# EAGLE design Witch (EAGLE 9.5.2)
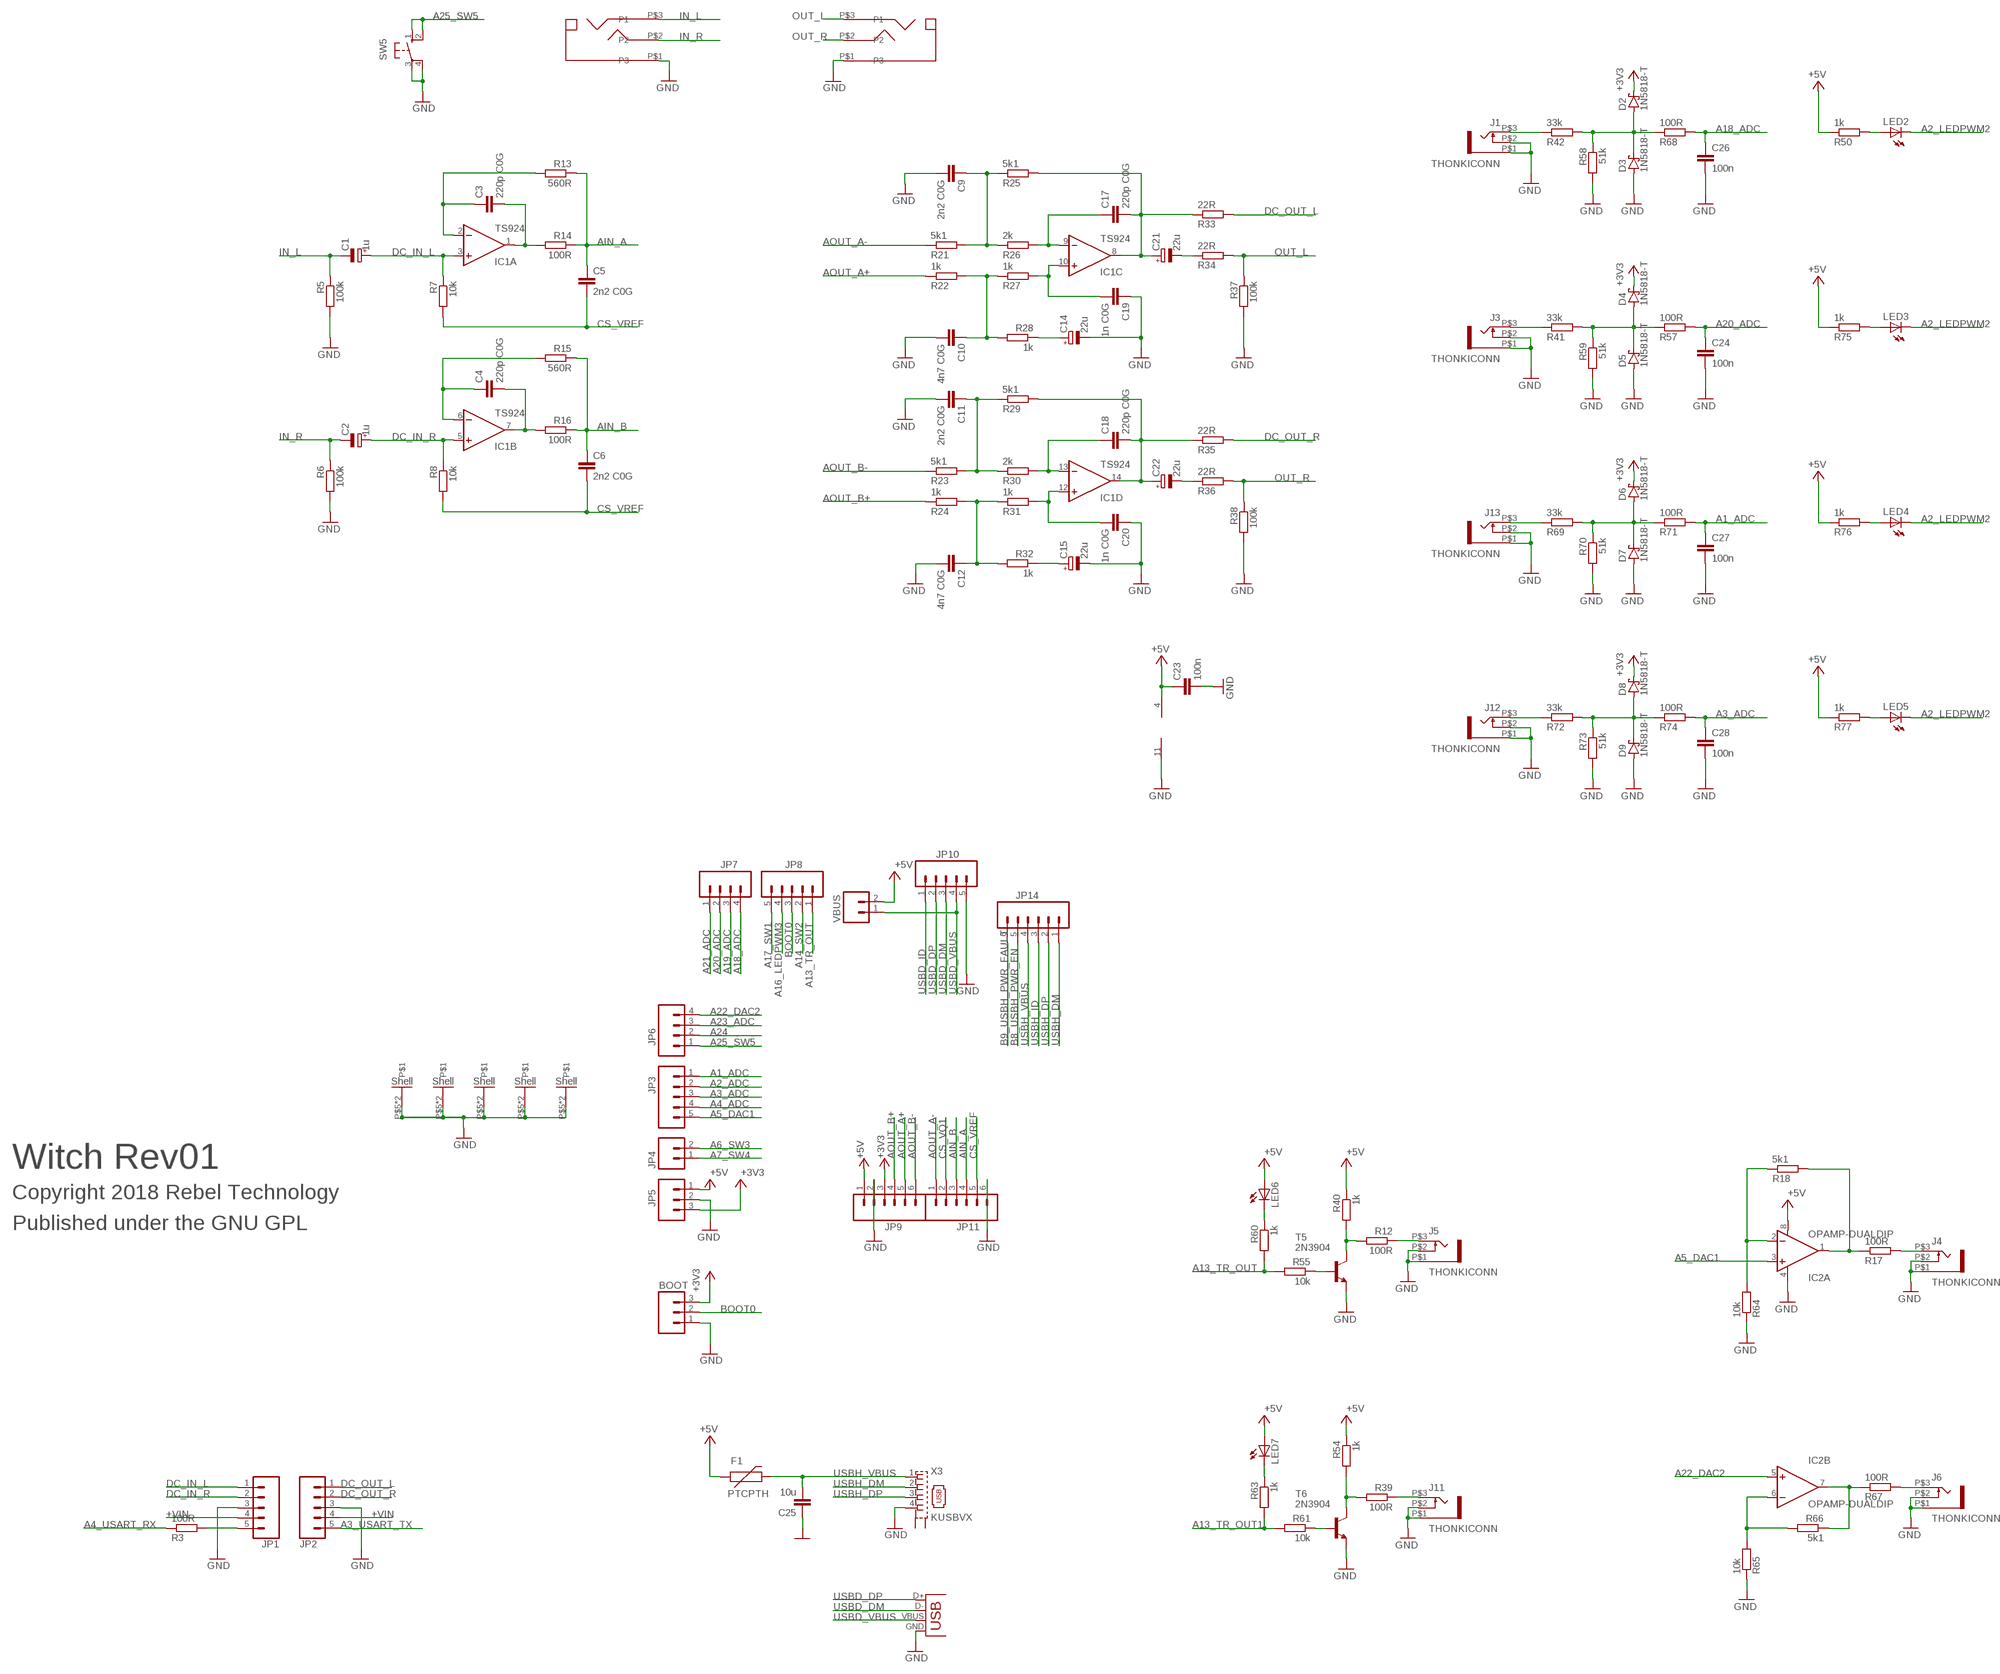
[diagram p0: schematic, sheet 1, part 1 of 2]
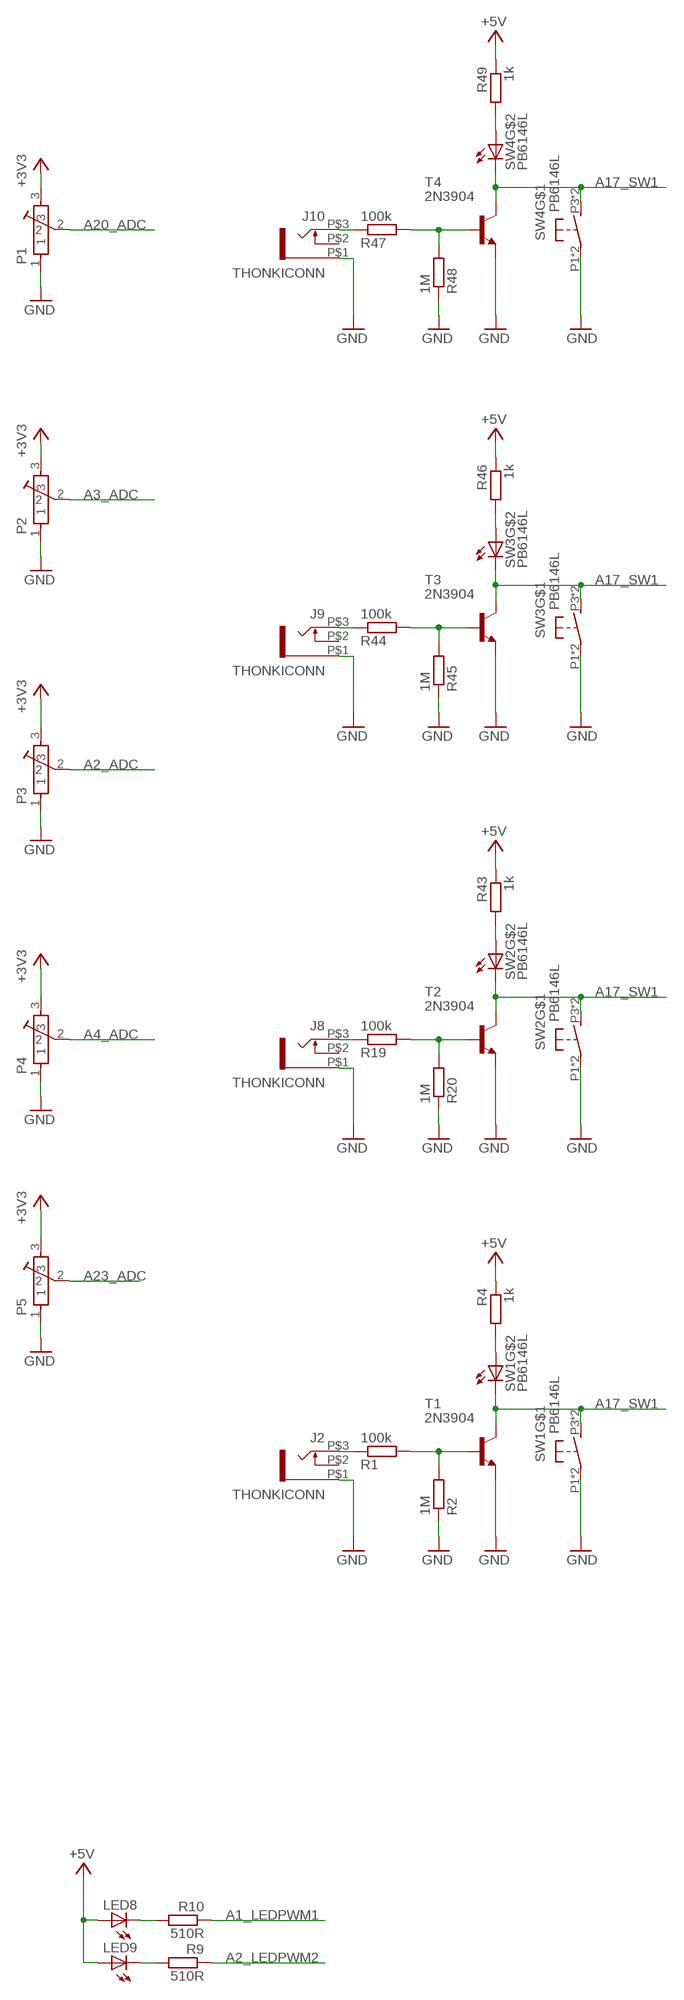
[diagram p1: schematic, sheet 1, part 2 of 2]

## Parts
BOOT  M03PTH  [1X03]
C1  1u  CPOL-EUE5-6  [E5-6]
C2  1u  CPOL-EUE5-6  [E5-6]
C3  220p C0G  C-EU050-024X044  [C050-024X044]
C4  220p C0G  C-EU050-024X044  [C050-024X044]
C5  2n2 C0G  C-EU050-024X044  [C050-024X044]
C6  2n2 C0G  C-EU050-024X044  [C050-024X044]
C9  2n2 C0G  C-EU050-024X044  [C050-024X044]
C10  4n7 C0G  C-EU050-024X044  [C050-024X044]
C11  2n2 C0G  C-EU050-024X044  [C050-024X044]
C12  4n7 C0G  C-EU050-024X044  [C050-024X044]
C14  22u  CPOL-EUE5-6  [E5-6]
C15  22u  CPOL-EUE5-6  [E5-6]
C17  220p C0G  C-EU050-024X044  [C050-024X044]
C18  220p C0G  C-EU050-024X044  [C050-024X044]
C19  1n C0G  C-EU050-024X044  [C050-024X044]
C20  1n C0G  C-EU050-024X044  [C050-024X044]
C21  22u  CPOL-EUE5-6  [E5-6]
C22  22u  CPOL-EUE5-6  [E5-6]
C23  100n  C-EU050-024X044  [C050-024X044]
C24  100n  C-EU050-024X044  [C050-024X044]
C25  10u  C-EU050-024X044  [C050-024X044]
C26  100n  C-EU050-024X044  [C050-024X044]
C27  100n  C-EU050-024X044  [C050-024X044]
C28  100n  C-EU050-024X044  [C050-024X044]
D2  1N5818-T  [DO41-7.6]
D3  1N5818-T  [DO41-7.6]
D4  1N5818-T  [DO41-7.6]
D5  1N5818-T  [DO41-7.6]
D6  1N5818-T  [DO41-7.6]
D7  1N5818-T  [DO41-7.6]
D8  1N5818-T  [DO41-7.6]
D9  1N5818-T  [DO41-7.6]
F1  PTCPTH  [PTC]
IC1  TS924  LM324N  [DIL14]
IC2  OPAMP-DUALDIP  [DIP08]
J1  THONKICONN  [THONKICONN]
J2  THONKICONN  [THONKICONN]
J3  THONKICONN  [THONKICONN]
J4  THONKICONN  [THONKICONN]
J5  THONKICONN  [THONKICONN]
J6  THONKICONN  [THONKICONN]
J8  THONKICONN  [THONKICONN]
J9  THONKICONN  [THONKICONN]
J10  THONKICONN  [THONKICONN]
J11  THONKICONN  [THONKICONN]
J12  THONKICONN  [THONKICONN]
J13  THONKICONN  [THONKICONN]
JP1  CONN_05JST-VERT  [JST-5-PTH-VERT]
JP2  CONN_05JST-VERT  [JST-5-PTH-VERT]
JP3  M05PTH  [1X05]
JP4  M02PTH  [1X02]
JP5  M03PTH  [1X03]
JP6  M04PTH  [1X04]
JP7  M04PTH  [1X04]
JP8  M05PTH  [1X05]
JP9  M06SIP  [1X06]
JP10  M05PTH  [1X05]
JP11  M06SIP  [1X06]
JP14  M06SIP  [1X06]
LED2  LED3MM  [LED3MM]
LED3  LED3MM  [LED3MM]
LED4  LED3MM  [LED3MM]
LED5  LED3MM  [LED3MM]
LED6  LED3MM  [LED3MM]
LED7  LED3MM  [LED3MM]
LED8  LED3MM  [LED3MM]
LED9  LED3MM  [LED3MM]
P1  POT-ALPS-RK09L1140  [POT-ALPS-RK09L1140]
P2  POT-ALPS-RK09L1140  [POT-ALPS-RK09L1140]
P3  POT-ALPS-RK09L1140  [POT-ALPS-RK09L1140]
P4  POT-ALPS-RK09L1140  [POT-ALPS-RK09L1140]
P5  POT-ALPS-RK09L1140  [POT-ALPS-RK09L1140]
R1  100k  R-EU_0204/7  [0204/7]
R2  1M  R-EU_0204/7  [0204/7]
R3  100R  R-EU_0204/7  [0204/7]
R4  1k  R-EU_0204/7  [0204/7]
R5  100k  R-EU_0204/7  [0204/7]
R6  100k  R-EU_0204/7  [0204/7]
R7  10k  R-EU_0204/7  [0204/7]
R8  10k  R-EU_0204/7  [0204/7]
R9  510R  R-EU_0204/7  [0204/7]
R10  510R  R-EU_0204/7  [0204/7]
R12  100R  R-EU_0204/7  [0204/7]
R13  560R  R-EU_0204/7  [0204/7]
R14  100R  R-EU_0204/7  [0204/7]
R15  560R  R-EU_0204/7  [0204/7]
R16  100R  R-EU_0204/7  [0204/7]
R17  100R  R-EU_0204/7  [0204/7]
R18  5k1  R-EU_0204/7  [0204/7]
R19  100k  R-EU_0204/7  [0204/7]
R20  1M  R-EU_0204/7  [0204/7]
R21  5k1  R-EU_0204/7  [0204/7]
R22  1k  R-EU_0204/7  [0204/7]
R23  5k1  R-EU_0204/7  [0204/7]
R24  1k  R-EU_0204/7  [0204/7]
R25  5k1  R-EU_0204/7  [0204/7]
R26  2k  R-EU_0204/7  [0204/7]
R27  1k  R-EU_0204/7  [0204/7]
R28  1k  R-EU_0204/7  [0204/7]
R29  5k1  R-EU_0204/7  [0204/7]
R30  2k  R-EU_0204/7  [0204/7]
R31  1k  R-EU_0204/7  [0204/7]
R32  1k  R-EU_0204/7  [0204/7]
R33  22R  R-EU_0204/7  [0204/7]
R34  22R  R-EU_0204/7  [0204/7]
R35  22R  R-EU_0204/7  [0204/7]
R36  22R  R-EU_0204/7  [0204/7]
R37  100k  R-EU_0204/7  [0204/7]
R38  100k  R-EU_0204/7  [0204/7]
R39  100R  R-EU_0204/7  [0204/7]
R40  1k  R-EU_0204/7  [0204/7]
R41  33k  R-EU_0204/7  [0204/7]
R42  33k  R-EU_0204/7  [0204/7]
R43  1k  R-EU_0204/7  [0204/7]
R44  100k  R-EU_0204/7  [0204/7]
R45  1M  R-EU_0204/7  [0204/7]
R46  1k  R-EU_0204/7  [0204/7]
R47  100k  R-EU_0204/7  [0204/7]
R48  1M  R-EU_0204/7  [0204/7]
R49  1k  R-EU_0204/7  [0204/7]
R50  1k  R-EU_0204/7  [0204/7]
R54  1k  R-EU_0204/7  [0204/7]
R55  10k  R-EU_0204/7  [0204/7]
R57  100R  R-EU_0204/7  [0204/7]
R58  51k  R-EU_0204/7  [0204/7]
R59  51k  R-EU_0204/7  [0204/7]
R60  1k  R-EU_0204/7  [0204/7]
R61  10k  R-EU_0204/7  [0204/7]
R63  1k  R-EU_0204/7  [0204/7]
R64  10k  R-EU_0204/7  [0204/7]
R65  10k  R-EU_0204/7  [0204/7]
R66  5k1  R-EU_0204/7  [0204/7]
R67  100R  R-EU_0204/7  [0204/7]
R68  100R  R-EU_0204/7  [0204/7]
R69  33k  R-EU_0204/7  [0204/7]
R70  51k  R-EU_0204/7  [0204/7]
R71  100R  R-EU_0204/7  [0204/7]
R72  33k  R-EU_0204/7  [0204/7]
R73  51k  R-EU_0204/7  [0204/7]
R74  100R  R-EU_0204/7  [0204/7]
R75  1k  R-EU_0204/7  [0204/7]
R76  1k  R-EU_0204/7  [0204/7]
R77  1k  R-EU_0204/7  [0204/7]
SW1  PB6146L  [PB6146L]
SW2  PB6146L  [PB6146L]
SW3  PB6146L  [PB6146L]
SW4  PB6146L  [PB6146L]
SW5  10-XX  [B3F-10XX]
T1  2N3904  [TO92]
T2  2N3904  [TO92]
T3  2N3904  [TO92]
T4  2N3904  [TO92]
T5  2N3904  [TO92]
T6  2N3904  [TO92]
U$4  THONKICONN_STEREO  [THONKICONN_STEREO]
U$5  THONKICONN_STEREO  [THONKICONN_STEREO]
VBUS  M02PTH  [1X02]
X3  KUSBVX  [KUSBVX]
X5  USBPTH-VERTICAL  [USB-B-PTH-VERTICAL]

## Nets
+3V3: BOOT.3 D2.C D4.C D6.C D8.C JP5.3 JP9.3 P1.3 P2.3 P3.3 P4.3 P5.3
+5V: C23.1 F1.P$1 IC1.4(P:V+) IC2.8(A:V+) JP5.1 JP9.1 LED6.A LED7.A LED8.A LED9.A R4.1 R40.1 R43.1 R46.1 R49.1 R50.1 R54.1 R75.1 R76.1 R77.1 VBUS.2
+VIN: JP1.4 JP2.4
A1_ADC: C27.1 JP3.1 R71.2
A1_LEDPWM1: R10.1
A2_ADC: JP3.2 P3.2
A2_LEDPWM2: LED2.K(C) LED3.K(C) LED4.K(C) LED5.K(C) R9.1
A3_ADC: C28.1 JP3.3 R74.2
A3_USART_TX: JP2.5
A4_ADC: JP3.4 P4.2
A4_USART_RX: R3.1
A5_DAC1: IC2.3(A:+IN) JP3.5
A6_SW3: JP4.2
A7_SW4: JP4.1
A13_TR_OUT: JP8.1 R55.2 R60.2
A13_TR_OUT1: R61.2 R63.2
A14_SW2: JP8.2
A16_LEDPWM3: JP8.4
A17_SW1: JP8.5 SW1.P3(S) SW1.P4(S) SW1.PL2(C) SW2.P3(S) SW2.P4(S) SW2.PL2(C) SW3.P3(S) SW3.P4(S) SW3.PL2(C) SW4.P3(S) SW4.P4(S) SW4.PL2(C) T1.1(C) T2.1(C) T3.1(C) T4.1(C)
A18_ADC: C26.1 JP7.4 R68.2
A19_ADC: JP7.3 P1.2
A20_ADC: C24.1 JP7.2 R57.2
A21_ADC: JP7.1 P2.2
A22_DAC2: IC2.5(B:+IN) JP6.4
A23_ADC: JP6.3 P5.2
A24: JP6.2
A25_SW5: JP6.1 SW5.1(S) SW5.2(S1)
AIN_A: C5.1 JP11.4 R13.1 R14.1
AIN_B: C6.1 JP11.3 R15.1 R16.1
AOUT_A+: JP9.5 R22.1
AOUT_A-: JP11.1 R21.1
AOUT_B+: JP9.4 R24.1
AOUT_B-: JP9.6 R23.1
B8_USBH_PWR_EN: JP14.5
B9_USBH_PWR_FAULT: JP14.6
BOOT0: BOOT.2 JP8.3
CS_VQ1: JP11.2
CS_VREF: C5.2 C6.2 JP11.5 R7.2 R8.2
DC_IN_L: C1.+ IC1.3(A:+IN) JP1.1 R7.1
DC_IN_R: C2.+ IC1.5(B:+IN) JP1.2 R8.1
DC_OUT_L: JP2.1 R33.2
DC_OUT_R: JP2.2 R35.2
GND: BOOT.1 C9.2 C10.2 C11.2 C12.2 C14.- C15.- C19.1 C20.1 C23.2 C24.2 C25.1 C26.2 C27.2 C28.2 D3.A D5.A D7.A D9.A IC1.11(P:V-) IC2.4(A:V-) J1.P$1 J1.P$2 J2.P$1 J3.P$1 J3.P$2 J4.P$1 J4.P$2 J5.P$1 J5.P$2 J6.P$1 J6.P$2 J8.P$1 J9.P$1 J10.P$1 J11.P$1 J11.P$2 J12.P$1 J12.P$2 J13.P$1 J13.P$2 JP1.3 JP2.3 JP5.2 JP9.2 JP10.5 JP11.6 P1.1 P1.P$5 P1.P$6 P2.1 P2.P$5 P2.P$6 P3.1 P3.P$5 P3.P$6 P4.1 P4.P$5 P4.P$6 P5.1 P5.P$5 P5.P$6 R2.1 R5.2 R6.2 R20.1 R37.2 R38.2 R45.1 R48.1 R58.2 R59.2 R64.1 R65.1 R70.2 R73.2 SW1.P1(P) SW1.P2(P) SW2.P1(P) SW2.P2(P) SW3.P1(P) SW3.P2(P) SW4.P1(P) SW4.P2(P) SW5.3(P) SW5.4(P1) T1.3(E) T2.3(E) T3.3(E) T4.3(E) T5.3(E) T6.3(E) U$4.P$1(P3) U$5.P$1(P3) X3.4 X5.GND
IN_L: C1.- R5.1 U$4.P$3(P1)
IN_R: C2.- R6.1 U$4.P$2(P2)
N$1: JP1.5 R3.2
N$2: J11.P$3 R39.1
N$3: C3.1 IC1.2(A:-IN) R13.2
N$4: C4.2 IC1.7(B:OUT) R16.2
N$5: C4.1 IC1.6(B:-IN) R15.2
N$6: C3.2 IC1.1(A:OUT) R14.2
N$7: C17.1 IC1.9(C:-IN) R26.2
N$8: C15.+ R32.1
N$9: C21.- R34.1
N$10: C14.+ R28.1
N$11: C19.2 IC1.10(C:+IN) R27.2
N$12: C18.2 C22.+ IC1.14(D:OUT) R29.2 R35.1
N$13: C22.- R36.1
N$14: LED8.K(C) R10.2
N$15: C10.1 R22.2 R27.1 R28.2
N$16: LED9.K(C) R9.2
N$17: D4.A D5.C R41.2 R57.1 R59.1
N$18: LED7.K(C) R63.1
N$19: J5.P$3 R12.1
N$20: IC2.2(A:-IN) R18.1 R64.2
N$21: IC2.1(A:OUT) R17.1 R18.2
N$22: J2.P$3 R1.1
N$23: R39.2 R54.2 T6.1(C)
N$24: C11.1 R23.2 R29.1 R30.1
N$25: R12.2 R40.2 T5.1(C)
N$26: C18.1 IC1.13(D:-IN) R30.2
N$27: J3.P$3 R41.1
N$28: R4.2 SW1.PL1(A)
N$29: R19.2 R20.2 T2.2(B)
N$30: C20.2 IC1.12(D:+IN) R31.2
N$31: R55.1 T5.2(B)
N$32: C12.1 R24.2 R31.1 R32.2
N$33: J1.P$3 R42.1
N$34: J8.P$3 R19.1
N$35: R43.2 SW2.PL1(A)
N$36: R44.2 R45.2 T3.2(B)
N$37: R1.2 R2.2 T1.2(B)
N$38: J9.P$3 R44.1
N$39: C17.2 C21.+ IC1.8(C:OUT) R25.2 R33.1
N$40: R46.2 SW3.PL1(A)
N$41: C9.1 R21.2 R25.1 R26.1
N$42: R47.2 R48.2 T4.2(B)
N$43: J10.P$3 R47.1
N$44: R49.2 SW4.PL1(A)
N$45: LED2.A R50.2
N$46: LED6.K(C) R60.1
N$52: D2.A D3.C R42.2 R58.1 R68.1
N$53: J13.P$3 R69.1
N$54: R61.1 T6.2(B)
N$58: D6.A D7.C R69.2 R70.1 R71.1
N$59: J12.P$3 R72.1
N$60: J4.P$3 R17.2
N$61: IC2.6(B:-IN) R65.2 R66.2
N$62: IC2.7(B:OUT) R66.1 R67.1
N$63: J6.P$3 R67.2
N$64: D8.A D9.C R72.2 R73.1 R74.1
N$65: LED3.A R75.2
N$66: LED4.A R76.2
N$67: LED5.A R77.2
OUT_L: R34.2 R37.1 U$5.P$3(P1)
OUT_R: R36.2 R38.1 U$5.P$2(P2)
USBD_DM: JP10.3 X5.D-
USBD_DP: JP10.2 X5.D+
USBD_ID: JP10.1
USBD_VBUS: JP10.4 VBUS.1 X5.VBUS
USBH_DM: JP14.1 X3.2
USBH_DP: JP14.2 X3.3
USBH_ID: JP14.3
USBH_VBUS: C25.2 F1.P$2 JP14.4 X3.1
Unconnected: J2.P$2 J8.P$2 J9.P$2 J10.P$2 X3.M1(S1) X3.M2(S2)

## Notes on the sheet
- Witch Rev01
- Copyright 2018 Rebel Technology
- Published under the GNU GPL

## Library data of the parts
BOOT JP5 = SparkFun:M03: Header 3 Standard 3-pin 0.1" header. Use with straight break away headers (SKU : PRT-00116), right angle break away headers (PRT-00553), swiss pins (PRT-00743), machine pins (PRT-00117), and female headers (PRT-00115). Molex polarized connector foot print use with SKU : PRT-08232 with associated crimp pins and housings.
C1 C2 C14 C15 C21 C22 = Rebel:CPOL-EU: POLARIZED CAPACITOR, European symbol
C3-C6 C9-C12 C17-C20 C23-C28 = resistor:C-EU: CAPACITOR, European symbol
D2-D9 = diode:1N581*: 1.0A SCHOTTKY BARRIER RECTIFIER Source: http://www.diodes.com/datasheets/ds23001.pdf
F1 = Rebel:PTC: Resettable Fuse PTC Resettable Fuse. Bourns MF-R, Raychem PolySwitch RXE.
IC1 = linear:LM324: OP AMP
IC2 = SparkFun:OPAMP-DUAL: Operational Amplifier
J1-J6 J8-J13 = Rebel:THONKICONN
JP1 JP2 = SparkFun-Connectors:CONN_05: Multi connection point. Often used as Generic Header-pin footprint for 0.1 inch spaced/style header connections On any of the 0.1 inch spaced packages, you can populate with these: Break Away Headers - Straight <https://www.sparkfun.com/products/116> (PRT-00116) Break Away Male Headers - Right Angle <https://www.sparkfun.com/products/553> (PRT-00553) Female Headers <https://www.sparkfun.com/products/115> (PRT-00115) Break Away Headers - Machine Pin <https://www.sparkfun.com/products/117> (PRT-00117) Break Away Female Headers - Swiss Machine Pin <https://www.sparkfun.com/products/743> (PRT-00743) For SCREWTERMINALS and SPRING TERMINALS visit here: Screw Terimnals on SparkFun.com <https://www.sparkfun.com/search/results?term=Screw+Terminals> (5mm/3.5mm/2.54mm spacing) This device is also useful as a general connection point to wire up your design to another part of your project. Our various solder wires solder well into these plated through hole pads. Hook-Up Wire - Assortment (Stranded, 22 AWG) <https://www.sparkfun.com/products/11375> (PRT-11375) Hook-Up Wire - Assortment (Solid Core, 22 AWG) <https://www.sparkfun.com/products/11367> (PRT-11367) View the entire wire category on our website here <https://www.sparkfun.com/categories/141> Special notes: Molex polarized connector foot print use with SKU : PRT-08231 with associated crimp pins and housings. 1MM SMD Version SKU: PRT-10208
JP3 JP8 JP10 = SparkFun:M05: Header 5 Standard 5-pin 0.1" header. Use with straight break away headers (SKU : PRT-00116), right angle break away headers (PRT-00553), swiss pins (PRT-00743), machine pins (PRT-00117), and female headers (PRT-00115). Molex polarized connector foot print use with SKU : PRT-08230 with associated crimp pins and housings.
JP4 VBUS = SparkFun:M02: Header 2 Standard 2-pin 0.1" header. Use with straight break away headers (SKU : PRT-00116), right angle break away headers (PRT-00553), swiss pins (PRT-00743), machine pins (PRT-00117), and female headers (PRT-00115). Molex polarized connector foot print use with SKU : PRT-08233 with associated crimp pins and housings.
JP6 JP7 = SparkFun:M04: Header 4 Standard 4-pin 0.1" header. Use with straight break away headers (SKU : PRT-00116), right angle break away headers (PRT-00553), swiss pins (PRT-00743), machine pins (PRT-00117), and female headers (PRT-00115). Molex polarized connector foot print use with SKU : PRT-08231 with associated crimp pins and housings. 1MM SMD Version SKU: PRT-10208
JP9 JP11 JP14 = SparkFun:M06: Header 6 Standard 6-pin 0.1" header. Use with straight break away headers (SKU : PRT-00116), right angle break away headers (PRT-00553), swiss pins (PRT-00743), machine pins (PRT-00117), and female headers (PRT-00115). Molex polarized connector foot print use with SKU : PRT-08094 with associated crimp pins and housings. NOTES ON THE VARIANTS LOCK and LOCK_LONGPADS... This footprint was designed to help hold the alignment of a through-hole component (i.e. 6-pin header) while soldering it into place. You may notice that each hole has been shifted either up or down by 0.005 of an inch from it's more standard position (which is a perfectly straight line). This slight alteration caused the pins (the squares in the middle) to touch the edges of the holes. Because they are alternating, it causes a "brace" to hold the component in place. 0.005 has proven to be the perfect amount of "off-center" position when using our standard breakaway headers. Although looks a little odd when you look at the bare footprint, once you have a header in there, the alteration is very hard to notice. Also, if you push a header all the way into place, it is covered up entirely on the bottom side. This idea of altering the position of holes to aid alignment will be further integrated into the Sparkfun Library for other footprints. It can help hold any component with 3 or more connection pins.
LED2-LED9 = Rebel:LED: LED
P1-P5 = Rebel:POT-ALPS-RK09L
R1-R10 R12-R50 R54 R55 R57-R61 R63-R77 = Rebel:R-EU_: RESISTOR, European symbol
SW1-SW4 = Rebel:PB6146L
SW5 = switch-omron:10-XX: OMRON SWITCH; MPN: B3F-1000; OC_FARNELL: 176432; OC_NEWARK: 36M3542
T1-T6 = transistor-npn:2N3904: NPN Transistor
U$4 U$5 = Rebel:THONKICONN_STEREO
X3 = con-kycon:KUSBVX: Vertical,Top Entry Universal Serial Bus Connector KUSBVX Series Source: KYCON Sibalco USB vertical socket KUSBV.pdf
X5 = SparkFun:USB: USB Connectors USB-B-PTH is fully proven SKU : PRT-00139 USB-miniB is fully proven SKU : PRT-00587 USB-A-PCB is untested. USB-A-H is throughly reviewed, but untested. Spark Fun Electronics SKU : PRT-00437 USB-B-SMT is throughly reviewed, but untested. Needs silkscreen touching up. USB-A-S has not been used/tested USB-MB-H has not been used/tested

## Net classes
1 power: width 0.178 mm, drill 0.305 mm, clearance 0.178 mm to class 0, clearance 0.178 mm

## Board
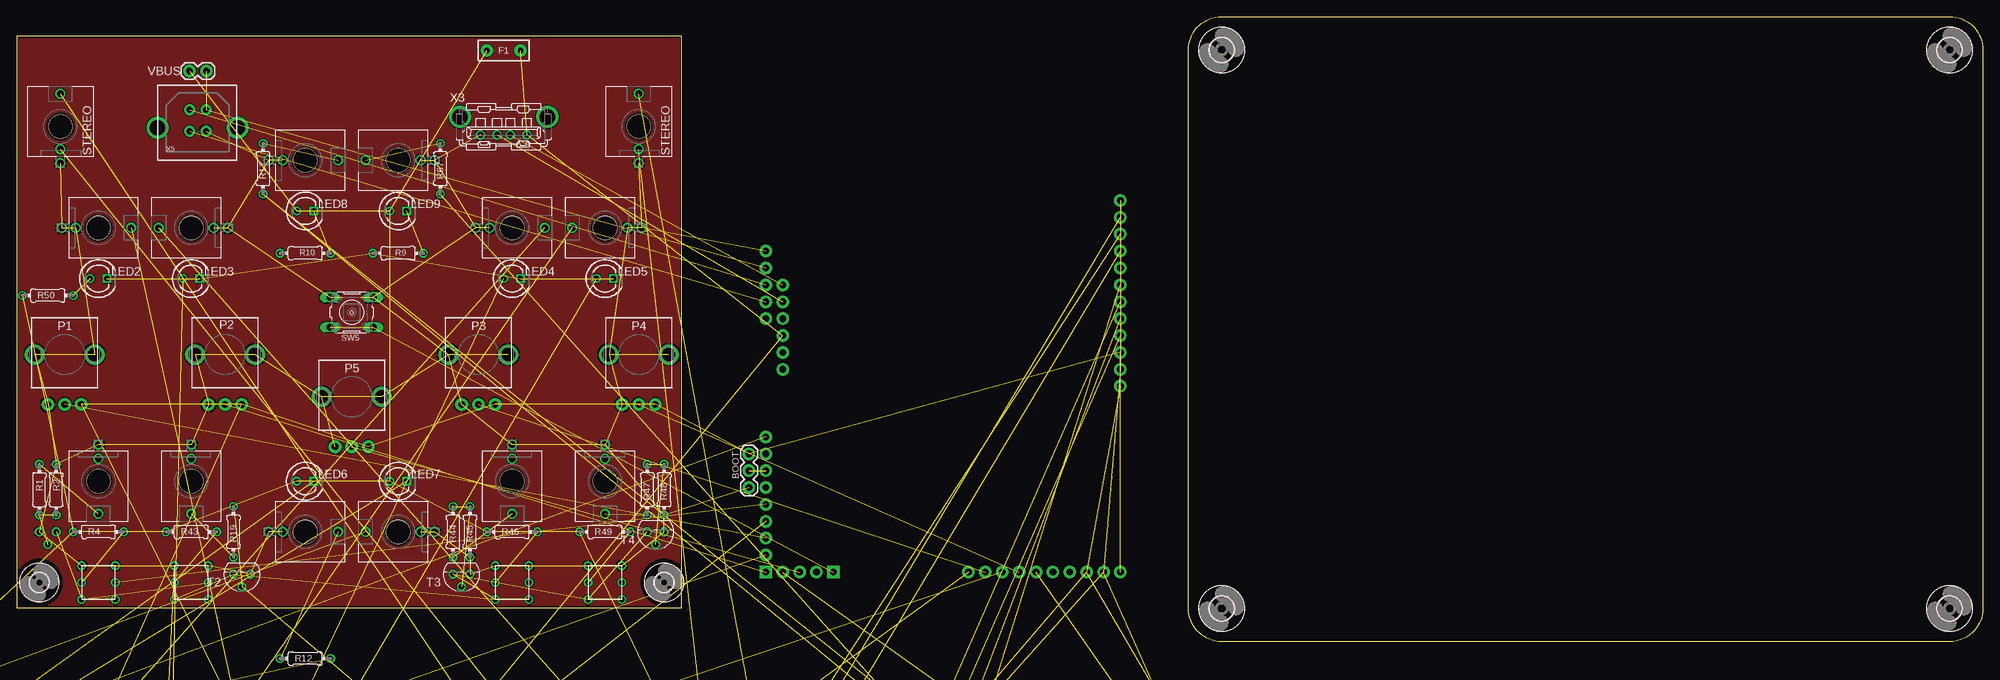
[diagram p2: board, top side]
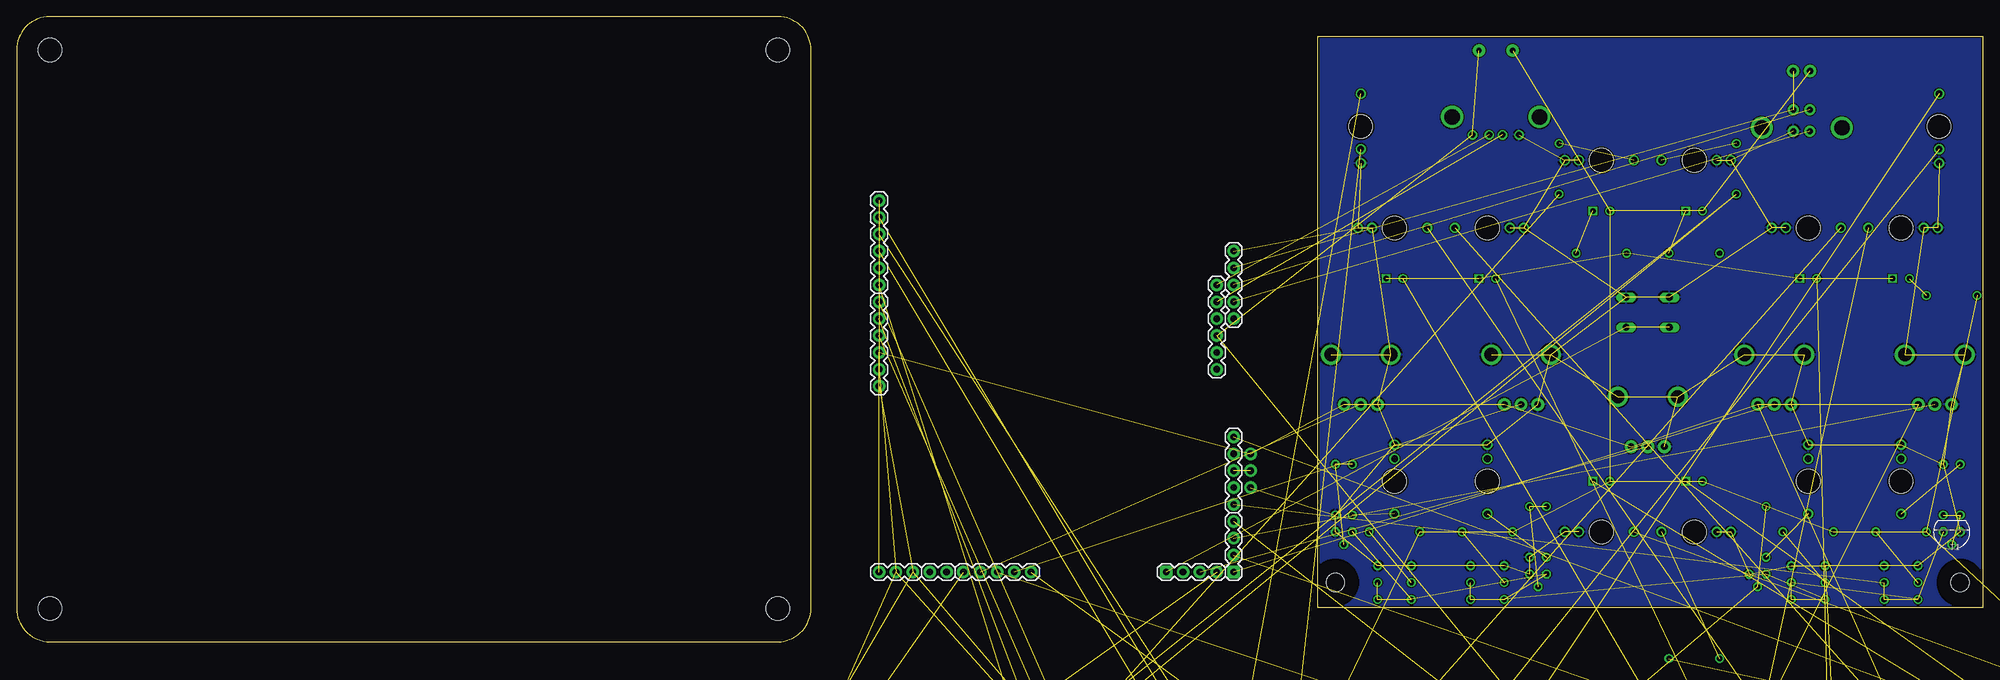
[diagram p3: board, bottom side, seen from below]

Size 295.78 x 94 mm. Coordinates in mm from the lower left corner, seen from the top.
Outline: 100,91.08 0,91.08 0,5.08 100,5.08 100,91.08
Outline: 290.78,0 181.28,0 arc-90 176.28,5 176.28,89 arc-90 181.28,94 290.78,94 arc-90 295.78,89 295.78,5 arc-90 290.78,0
Copper layers (1*16): Top 0.035mm / dielectric 1.5mm / Bottom 0.035mm
Design rules "Fusion_eagle_rule_v1.1": minimum track width 6mil, minimum drill 12mil, track to track 6mil, track to pad 6mil, pad to pad 6mil, via to via 6mil, smd to smd 0mil, copper to edge 10mil, drill to drill 10mil, minimum pad ring 10mil, minimum via ring 6mil, stop-mask expansion 2mil, vias tented up to drill 100mil, thermal gap 10mil

### Footprints (pad centres in the part's own frame; a part is rotated, then mirrored left to right if it is on the bottom)
1X03 = drill 1.016 pad 1.88: 1 0,0; 2 2.54,0; 3 5.08,0
E5-6 = drill 0.813 pad 1.905: + -2.54,0; - 2.54,0
C050-024X044 = drill 0.813 octagon: 1 -2.54,0; 2 2.54,0
DO41-7.6 = drill 1.1 pad 1.7: A 3.81,0; C -3.81,0
PTC = drill 0.8 pad 1.88: P$1 -2.54,0; P$2 2.54,0
DIL14 = drill 0.813 long: 1 -7.62,-3.81; 2 -5.08,-3.81; 3 -2.54,-3.81; 4 0,-3.81; 5 2.54,-3.81; 6 5.08,-3.81; 7 7.62,-3.81; 8 7.62,3.81; 9 5.08,3.81; 10 2.54,3.81; 11 0,3.81; 12 -2.54,3.81; 13 -5.08,3.81; 14 -7.62,3.81
DIP08 = drill 0.813 pad 1.727 octagon: 1 -3.81,-3.81; 2 -1.27,-3.81; 3 1.27,-3.81; 4 3.81,-3.81; 5 3.81,3.81; 6 1.27,3.81; 7 -1.27,3.81; 8 -3.81,3.81
THONKICONN = drill 1: P$1 0,-5.5; P$2 0,-3.38; P$3 0,4.92 | hole 3.6: 0,0
JST-5-PTH-VERT = drill 0.7 pad 1.6: 1 -4,0.18; 2 -2,0.18; 3 0,0.18; 4 2,0.18; 5 4,0.18
1X05 = drill 1.016 pad 1.88: 1 0,0; 2 2.54,0; 3 5.08,0; 4 7.62,0; 5 10.16,0
1X02 = drill 1.016 pad 1.88: 1 0,0; 2 2.54,0
1X04 = drill 1.016 pad 1.88 square: 1 0,0 | drill 1.016 pad 1.88: 2 2.54,0; 3 5.08,0; 4 7.62,0
1X06 = drill 1.016 pad 1.88: 1 0,0; 2 2.54,0; 3 5.08,0; 4 7.62,0; 5 10.16,0; 6 12.7,0
LED3MM = drill 0.813: A -1.27,0 | drill 0.813 square: K 1.27,0
POT-ALPS-RK09L1140 = drill 1 pad 1.93: 1 -2.5,-7.5; 2 0,-7.5; 3 2.5,-7.5 | drill 2: P$5 -4.5,0; P$6 4.5,0
0204/7 = drill 0.813: 1 -3.81,0; 2 3.81,0
PB6146L = drill 0.8: P1 -2.54,2.54; P2 2.54,2.54; P3 -2.54,-2.54; P4 2.54,-2.54; PL1 -2.54,0; PL2 2.54,0
B3F-10XX = drill 1.016 long: 1 -3.251,2.261; 2 3.251,2.261; 3 -3.251,-2.261; 4 3.251,-2.261
TO92 = drill 0.813 octagon: 1 1.27,0; 2 0,1.905; 3 -1.27,0
2,8 = hole 2.8: 0,0
THONKICONN_STEREO = drill 1: P$1 0,-5.5; P$2 0,-3.38; P$3 0,4.92 | hole 3.6: 0,0
3,6 = hole 3.6: 0,0
KUSBVX = drill 0.9 pad 1.3: 1 3.5,0; 2 1,0; 3 -1,0; 4 -3.5,0 | drill 2.3 pad 2.8: M1 -6.57,2.71; M2 6.57,2.71
USB-B-PTH-VERTICAL = drill 0.914 pad 1.676: D+ 4.826,4.394; D- 4.826,7.595; GND 7.315,4.394; VBUS 7.315,7.595 | drill 2.286: P$1 0,4.902; P$2 12.04,4.902

### Placement (x,y rotation side)
BOOT  110.16,23.18 90 top
C1  116.45,-27.94 180 top  (outside the outline)
C2  107.56,-27.94 180 top  (outside the outline)
C3  110.1,-35.56 90 top  (outside the outline)
C4  105.02,-58.42 270 top  (outside the outline)
C5  105.02,-35.56 270 top  (outside the outline)
C6  105.02,-50.8 90 top  (outside the outline)
C9  75.81,-39.37 0 top  (outside the outline)
C10  125.34,-45.72 180 top  (outside the outline)
C11  125.34,-35.56 0 top  (outside the outline)
C12  125.34,-40.64 180 top  (outside the outline)
C14  73.33,-27.62 180 top  (outside the outline)
C15  73.33,-21.27 180 top  (outside the outline)
C17  126.61,-55.88 90 top  (outside the outline)
C18  116.45,-41.91 0 top  (outside the outline)
C19  124.07,-55.88 270 top  (outside the outline)
C20  121.46,-55.88 90 top  (outside the outline)
C21  105.02,-64.77 0 top  (outside the outline)
C22  125.34,-73.66 90 top  (outside the outline)
C23  116.45,-44.45 0 top  (outside the outline)
C24  41.52,-15.24 0 top  (outside the outline)
C25  64.21,-19.23 180 top  (outside the outline)
C26  52.95,-30.48 0 top  (outside the outline)
C27  52.95,-57.15 0 top  (outside the outline)
C28  28.82,-30.48 0 top  (outside the outline)
D2  42.79,-22.86 0 top  (outside the outline)
D3  42.79,-30.48 0 top  (outside the outline)
D4  2.15,-26.67 180 top  (outside the outline)
D5  2.15,-30.48 180 top  (outside the outline)
D6  42.79,-49.53 0 top  (outside the outline)
D7  42.79,-57.15 0 top  (outside the outline)
D8  18.66,-22.86 0 top  (outside the outline)
D9  18.66,-30.48 0 top  (outside the outline)
F1  73.27,88.9 0 top
IC1  114.48,-56.2 270 top  (outside the outline)
IC2  202.81,-58.42 0 top  (outside the outline)
J1  12.31,62.23 270 top
J2  12.31,24.13 180 top
J3  26.28,62.23 90 top
J4  43.42,72.39 270 top
J5  43.42,16.51 270 top
J6  57.39,72.39 90 top
J8  26.28,24.13 180 top
J9  74.54,24.13 180 top
J10  88.51,24.13 180 top
J11  57.39,16.51 90 top
J12  88.51,62.23 90 top
J13  74.54,62.23 270 top
JP1  119.05,-17.14 0 top  (outside the outline)
JP2  107.49,-83.19 0 top  (outside the outline)
JP3  143.18,10.48 180 bottom
JP4  158.42,10.48 0 bottom
JP5  160.96,10.48 180 bottom
JP6  122.86,10.48 0 bottom
JP7  112.7,10.48 90 bottom
JP8  112.7,30.8 270 bottom
JP9  166.04,38.42 90 bottom
JP10  112.7,48.58 90 bottom
JP11  166.04,53.66 90 bottom
JP14  115.24,53.66 270 bottom
LED2  12.31,54.61 0 top
LED3  26.28,54.61 0 top
LED4  74.54,54.61 0 top
LED5  88.51,54.61 0 top
LED6  43.42,24.13 0 top
LED7  57.39,24.13 0 top
LED8  43.42,64.77 0 top
LED9  57.39,64.77 0 top
P1  7.23,43.18 0 top
P2  31.36,43.18 0 top
P3  69.46,43.18 0 top
P4  93.59,43.18 0 top
P5  50.41,36.83 0 top
R1  3.42,22.86 270 top
R2  5.96,22.86 270 top
R3  103.75,-74.93 90 top  (outside the outline)
R4  12.31,16.51 0 top
R5  125.34,-27.94 0 top  (outside the outline)
R6  116.45,-34.29 180 top  (outside the outline)
R7  92.32,-52.07 0 top  (outside the outline)
R8  107.56,-43.18 180 top  (outside the outline)
R9  57.39,58.42 0 top
R10  43.42,58.42 0 top
R12  43.42,-2.54 0 top
R13  107.56,-40.64 0 top  (outside the outline)
R14  107.56,-34.29 90 top  (outside the outline)
R15  107.56,-45.72 0 top  (outside the outline)
R16  107.56,-52.07 270 top  (outside the outline)
R17  37.07,71.12 90 top
R18  200.27,-69.85 0 top  (outside the outline)
R19  32.63,16.51 90 top
R20  130.42,-77.47 90 top  (outside the outline)
R21  125.34,-63.5 180 top  (outside the outline)
R22  125.34,-48.26 180 top  (outside the outline)
R23  125.34,-33.02 180 top  (outside the outline)
R24  125.34,-38.1 180 top  (outside the outline)
R25  125.34,-68.58 180 top  (outside the outline)
R26  125.34,-66.04 180 top  (outside the outline)
R27  125.34,-60.96 180 top  (outside the outline)
R28  75.68,-36.58 180 top  (outside the outline)
R29  116.45,-36.83 180 top  (outside the outline)
R30  116.45,-39.37 180 top  (outside the outline)
R31  125.34,-43.18 0 top  (outside the outline)
R32  125.34,-30.48 180 top  (outside the outline)
R33  118.12,-71.07 270 top  (outside the outline)
R34  106.29,-74.93 270 top  (outside the outline)
R35  115.29,-73.61 270 top  (outside the outline)
R36  125.34,-78.74 0 top  (outside the outline)
R37  108.83,-74.93 270 top  (outside the outline)
R38  125.34,-81.28 180 top  (outside the outline)
R39  -23.25,-12.7 0 top  (outside the outline)
R40  -38.49,-20.32 0 top  (outside the outline)
R41  125.34,-50.8 0 top  (outside the outline)
R42  42.79,-36.83 0 top  (outside the outline)
R43  26.28,16.51 0 top
R44  65.65,16.51 90 top
R45  68.19,16.51 90 top
R46  74.54,16.51 0 top
R47  94.86,22.86 90 top
R48  97.4,22.86 90 top
R49  88.51,16.51 0 top
R50  4.69,52.07 0 top
R54  -23.25,-16.51 0 top  (outside the outline)
R55  -38.49,-24.13 0 top  (outside the outline)
R57  42.79,-10.16 0 top  (outside the outline)
R58  42.79,-40.64 0 top  (outside the outline)
R59  182.49,-40.64 0 top  (outside the outline)
R60  -38.49,-38.1 0 top  (outside the outline)
R61  -23.25,-20.32 0 top  (outside the outline)
R63  -23.25,-27.94 0 top  (outside the outline)
R64  200.27,-73.66 0 top  (outside the outline)
R65  200.27,-77.47 0 top  (outside the outline)
R66  200.27,-81.28 0 top  (outside the outline)
R67  63.74,71.12 90 top
R68  42.79,-44.45 0 top  (outside the outline)
R69  18.66,-10.16 0 top  (outside the outline)
R70  18.66,-13.97 0 top  (outside the outline)
R71  18.66,-17.78 0 top  (outside the outline)
R72  18.66,-36.83 0 top  (outside the outline)
R73  18.66,-40.64 0 top  (outside the outline)
R74  18.66,-44.45 0 top  (outside the outline)
R75  18.66,-48.26 0 top  (outside the outline)
R76  18.66,-52.07 0 top  (outside the outline)
R77  18.66,-55.88 0 top  (outside the outline)
SW1  12.31,8.89 0 top
SW2  26.28,8.89 0 top
SW3  74.54,8.89 0 top
SW4  88.51,8.89 0 top
SW5  50.41,49.53 180 top
T1  4.69,16.51 180 bottom
T2  33.9,10.16 180 top
T3  66.92,10.16 180 top
T4  96.13,16.51 180 top
T5  -39.76,-15.24 0 top  (outside the outline)
T6  -23.25,-33.02 0 top  (outside the outline)
U$1  [2,8]  3.42,8.89 0 top
U$2  [2,8]  97.4,8.89 0 top
U$4  93.59,77.47 0 top
U$5  6.59,77.47 0 top
U$6  [3,6]  181.28,5 0 top
U$7  [3,6]  181.28,89 0 top
U$8  [3,6]  290.78,89 0 top
U$9  [3,6]  290.78,5 0 top
VBUS  28.54,85.82 180 top
X3  73.27,76.2 0 top
X5  21.2,72.39 0 top

### Tracks (layer width: path | path; a pad name or v marks a point on that pad's centre or on a via)
+3V3  (11 unrouted)
+5V  (20 unrouted)
+VIN  (1 unrouted)
A1_ADC  (2 unrouted)
A2_ADC  (1 unrouted)
A2_LEDPWM2  (4 unrouted)
A3_ADC  (2 unrouted)
A4_ADC  (1 unrouted)
A5_DAC1  (1 unrouted)
A13_TR_OUT  (2 unrouted)
A13_TR_OUT1  (1 unrouted)
A17_SW1  (16 unrouted)
A18_ADC  (2 unrouted)
A19_ADC  (1 unrouted)
A20_ADC  (2 unrouted)
A21_ADC  (1 unrouted)
A22_DAC2  (1 unrouted)
A23_ADC  (1 unrouted)
A25_SW5  (2 unrouted)
AIN_A  (3 unrouted)
AIN_B  (3 unrouted)
AOUT_A+  (1 unrouted)
AOUT_A-  (1 unrouted)
AOUT_B+  (1 unrouted)
AOUT_B-  (1 unrouted)
BOOT0  (1 unrouted)
CS_VREF  (4 unrouted)
DC_IN_L  (3 unrouted)
DC_IN_R  (3 unrouted)
DC_OUT_L  (1 unrouted)
DC_OUT_R  (1 unrouted)
GND  (95 unrouted)
  pour Bottom: -2.87,3.81 -2.87,91.44 103.81,91.44 103.81,3.81
  pour Top: -1.6,2.54 -1.6,92.71 105.08,92.71 105.08,2.54
IN_L  (2 unrouted)
IN_R  (2 unrouted)
N$1  (1 unrouted)
N$2  (1 unrouted)
N$3  (2 unrouted)
N$4  (2 unrouted)
N$5  (2 unrouted)
N$6  (2 unrouted)
N$7  (2 unrouted)
N$8  (1 unrouted)
N$9  (1 unrouted)
N$10  (1 unrouted)
N$11  (2 unrouted)
N$12  (4 unrouted)
N$13  (1 unrouted)
N$14  (1 unrouted)
N$15  (3 unrouted)
N$16  (1 unrouted)
N$17  (4 unrouted)
N$18  (1 unrouted)
N$19  (1 unrouted)
N$20  (2 unrouted)
N$21  (2 unrouted)
N$22  (1 unrouted)
N$23  (2 unrouted)
N$24  (3 unrouted)
N$25  (2 unrouted)
N$26  (2 unrouted)
N$27  (1 unrouted)
N$28  (1 unrouted)
N$29  (2 unrouted)
N$30  (2 unrouted)
N$31  (1 unrouted)
N$32  (3 unrouted)
N$33  (1 unrouted)
N$34  (1 unrouted)
N$35  (1 unrouted)
N$36  (2 unrouted)
N$37  (2 unrouted)
N$38  (1 unrouted)
N$39  (4 unrouted)
N$40  (1 unrouted)
N$41  (3 unrouted)
N$42  (2 unrouted)
N$43  (1 unrouted)
N$44  (1 unrouted)
N$45  (1 unrouted)
N$46  (1 unrouted)
N$52  (4 unrouted)
N$53  (1 unrouted)
N$54  (1 unrouted)
N$58  (4 unrouted)
N$59  (1 unrouted)
N$60  (1 unrouted)
N$61  (2 unrouted)
N$62  (2 unrouted)
N$63  (1 unrouted)
N$64  (4 unrouted)
N$65  (1 unrouted)
N$66  (1 unrouted)
N$67  (1 unrouted)
OUT_L  (2 unrouted)
OUT_R  (2 unrouted)
USBD_DM  (1 unrouted)
USBD_DP  (1 unrouted)
USBD_VBUS  (2 unrouted)
USBH_DM  (1 unrouted)
USBH_DP  (1 unrouted)
USBH_VBUS  (3 unrouted)

### Text on the board
tPlace: Rebel Technology | Wizard Rev02
bPlace: Rebel Technology | Wizard Rev02